# Altium schematic sheet 425AK01A_S02.SchDoc
size A3; DocumentNumber: 2; SheetNumber: 2; SheetTotal: 10; PageSetup: Record=PageOptions|CenterHorizontal=True|CenterVertical=True|PrintScale=1.01|XCorrection=1.00|YCorrection=1.00|PrintKind=1|BorderSize=5000000|LeftOffset=0|BottomOffset=0|Orientation=2|PaperLength=1000|PaperWidth=1000|Scale=100|PaperSource=15|PrintQuality=600|MediaType=1|DitherType=10|PaperKind=A3|PrintScaleMode=1; 00_Drawn: RJG; 00_Date: 8APR2022; 00_Checked: SR; 00_Approved: GN; 00_Line1: Microcontroller
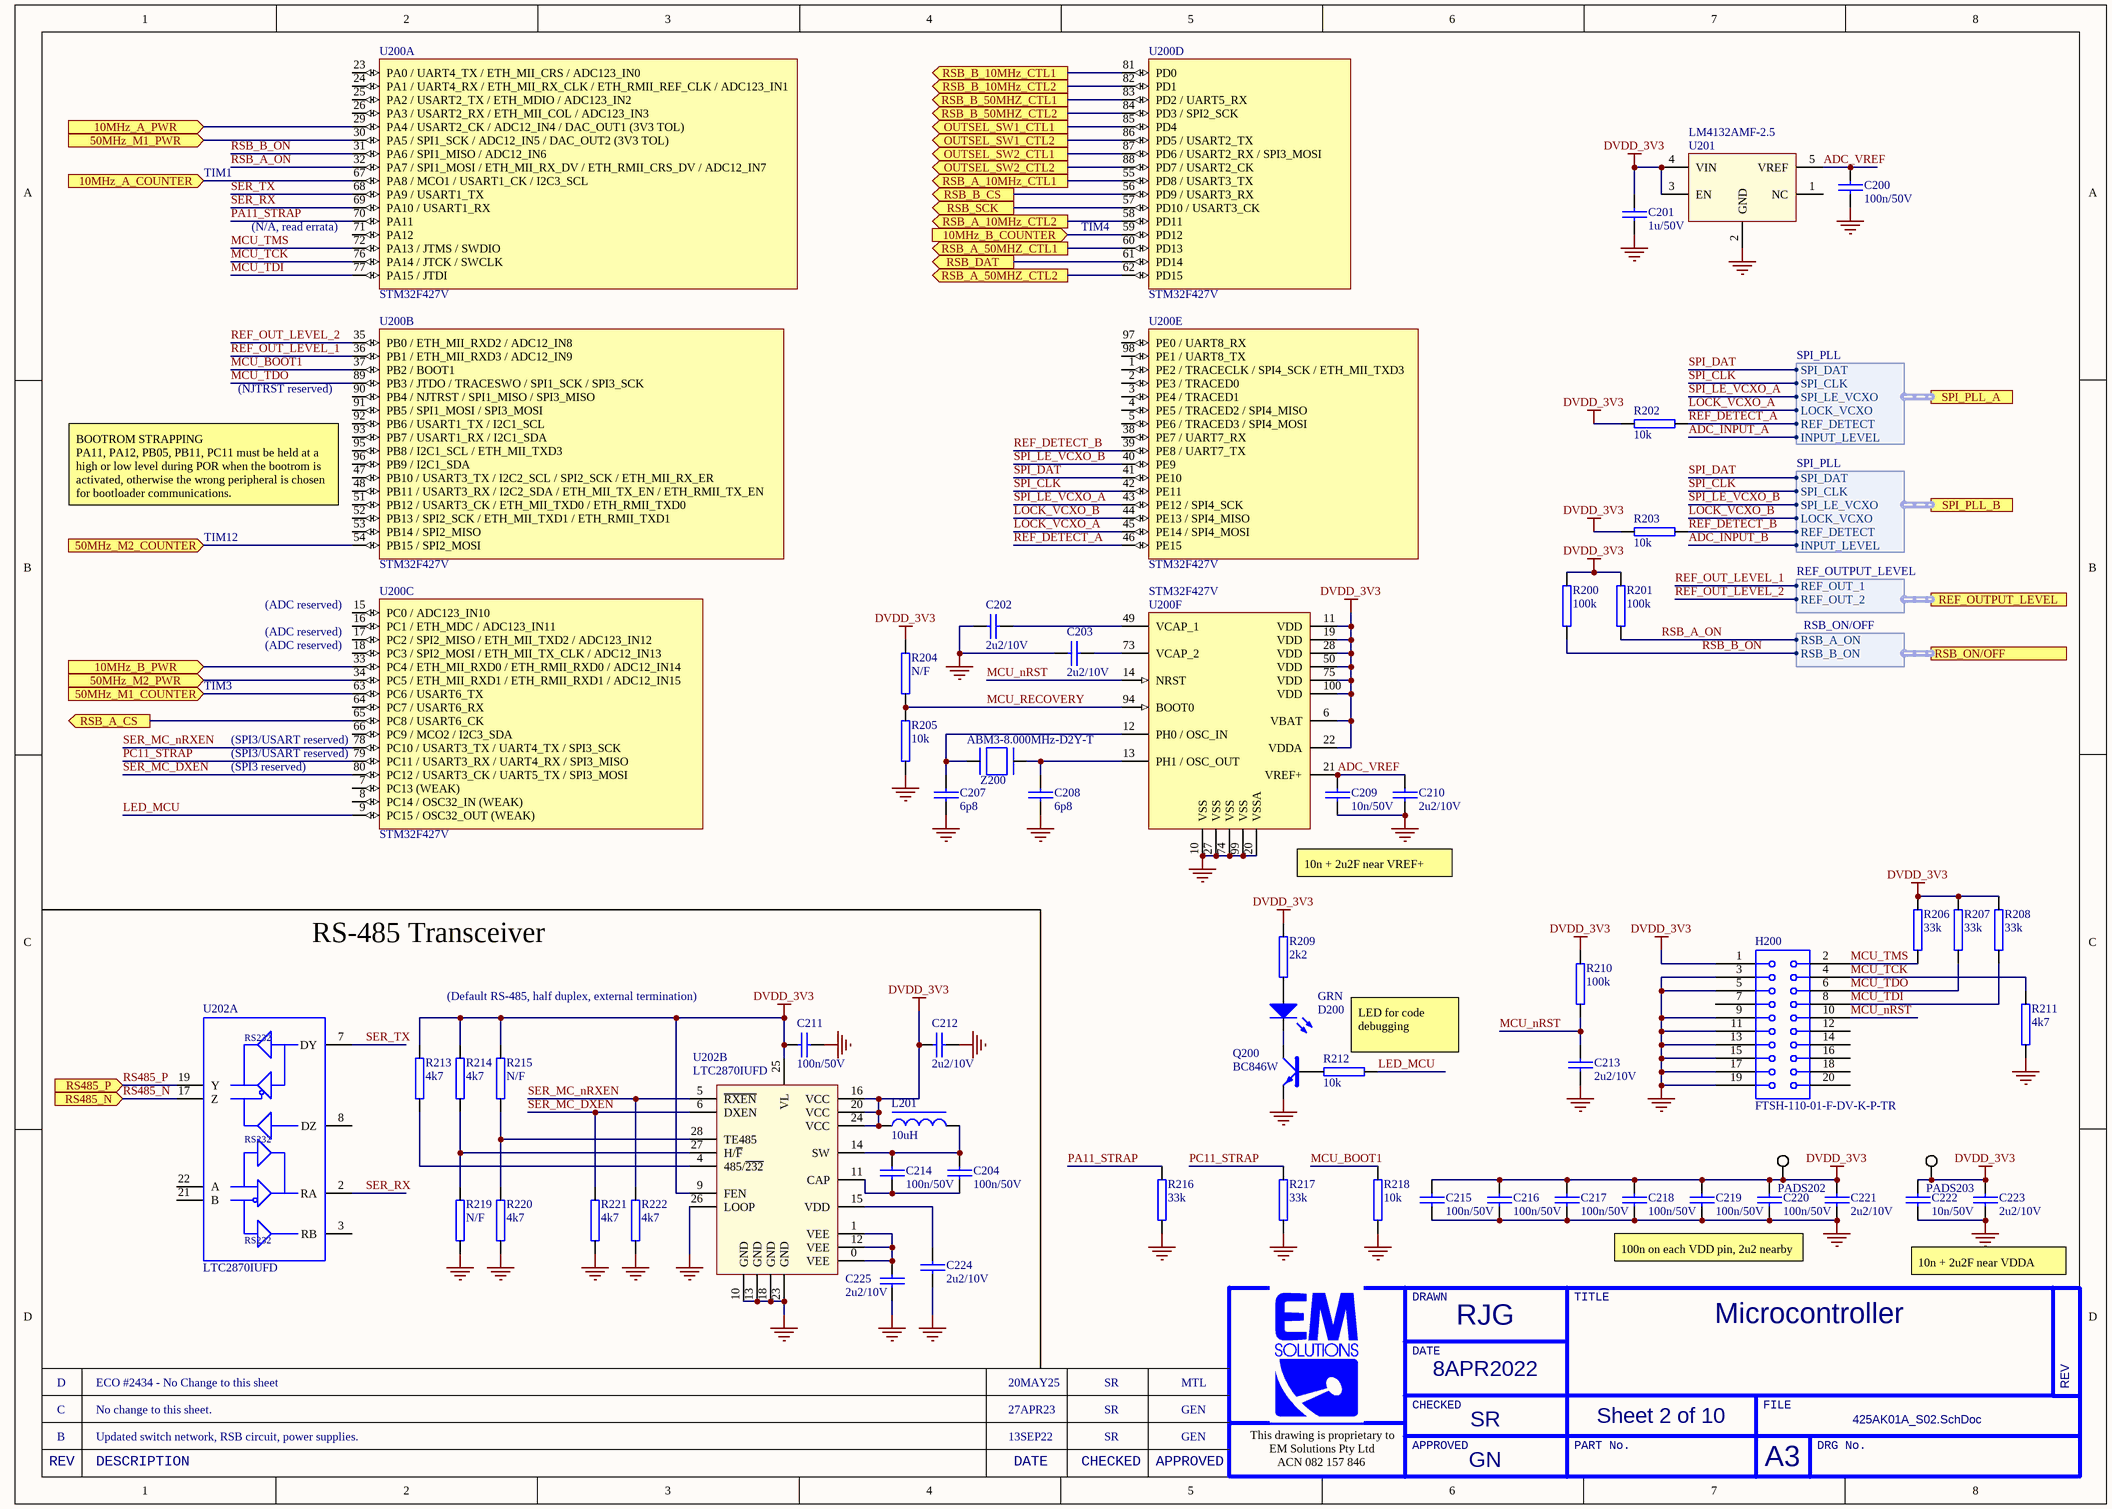
[diagram p0: 425AK01A_S02.SchDoc]

## Parts
C200  100n/50V  [0402C]
C201  1u/50V  [0603C]
C202  2u2/10V  [0603C]
C203  2u2/10V  [0603C]
C204  100n/50V  [0402C]
C207  6p8  [0402C]
C208  6p8  [0402C]
C209  10n/50V  [0402C]
C210  2u2/10V  [0603C]
C211  100n/50V  [0402C]
C212  2u2/10V  [0603C]
C213  2u2/10V  [0603C]
C214  100n/50V  [0402C]
C215  100n/50V  [0402C]
C216  100n/50V  [0402C]
C217  100n/50V  [0402C]
C218  100n/50V  [0402C]
C219  100n/50V  [0402C]
C220  100n/50V  [0402C]
C221  2u2/10V  [0603C]
C222  10n/50V  [0402C]
C223  2u2/10V  [0603C]
C224  2u2/10V  [0603C]
C225  2u2/10V  [0603C]
D200  GRN  [0603 LED]
H200  FTSH-110-01-F-DV-K-P-TR  [FTSH-110-01-F-DV-K]
L201  10uH  [0805L]
PADS202  Pads  [Pads-1x3-V3-0.3/0.6mm]  (value not drawn)  (net tie, no BOM)
PADS203  Pads  [Pads-1x3-V3-0.3/0.6mm]  (value not drawn)  (net tie, no BOM)
Q200  BC846W  [SOT-323BJT]
R200  100k  [0402]
R201  100k  [0402]
R202  10k  [0402]
R203  10k  [0402]
R204  N/F  [0402]
R205  10k  [0402]
R206  33k  [0402]
R207  33k  [0402]
R208  33k  [0402]
R209  2k2  [0402]
R210  100k  [0402]
R211  4k7  [0402]
R212  10k  [0402]
R213  4k7  [0402]
R214  4k7  [0402]
R215  N/F  [0402]
R216  33k  [0402]
R217  33k  [0402]
R218  10k  [0402]
R219  N/F  [0402]
R220  4k7  [0402]
R221  4k7  [0402]
R222  4k7  [0402]
U200  STM32F427V  [LQFP100]  (parts A,B,C,D,E,F of 6)
U201  LM4132AMF-2.5  [SOT-23/5]
U202  LTC2870IUFD  [QFN-28 4x5mm]  (parts A,B of 2)
Z200  ABM3-8.000MHz-D2Y-T  [ABM3]

## Ports
10MHz_A_COUNTER (in), 10MHz_A_PWR (in), 10MHz_B_COUNTER (in), 10MHz_B_PWR (in), 50MHz_M1_COUNTER (in), 50MHz_M1_PWR (in), 50MHz_M2_COUNTER (in), 50MHz_M2_PWR (in), OUTSEL_SW1_CTL1 (out), OUTSEL_SW1_CTL2 (out), OUTSEL_SW2_CTL1 (out), OUTSEL_SW2_CTL2 (out), REF_OUTPUT_LEVEL (harness REF_OUTPUT_LEVEL), RS485_N (in), RS485_P (in), RSB_A_10MHz_CTL1 (out), RSB_A_10MHz_CTL2 (out), RSB_A_50MHZ_CTL1 (out), RSB_A_50MHZ_CTL2 (out), RSB_A_CS (out), RSB_B_10MHz_CTL1 (out), RSB_B_10MHz_CTL2 (out), RSB_B_50MHZ_CTL1 (out), RSB_B_50MHZ_CTL2 (out), RSB_B_CS (out), RSB_DAT (out), RSB_ON/OFF (harness RSB_ON/OFF), RSB_SCK (out), SPI_PLL_A (harness SPI_PLL), SPI_PLL_B (harness SPI_PLL)

## Harnesses
SPI_PLL: SPI_LE_VCXO, SPI_CLK, SPI_DAT, REF_DETECT, LOCK_VCXO, INPUT_LEVEL
REF_OUTPUT_LEVEL: REF_OUT_1, REF_OUT_2
RSB_ON/OFF: RSB_A_ON, RSB_B_ON

## Nets
DVDD_3V3: C201.1 C211.1 C212.1 C215.1 C216.1 C217.1 C218.1 C219.1 C220.1 C221.1 C222.1 C223.1 H200.1 L201.1 PADS202.1 PADS203.1 R200.2 R201.2 R202.2 R203.2 R204.2 R206.2 R207.2 R208.2 R209.2 R210.2 R213.2 R214.2 R215.2 U200.6(VBAT) U200.11(VDD) U200.19(VDD) U200.22(VDDA) U200.28(VDD) U200.50(VDD) U200.75(VDD) U200.100(VDD) U201.3(EN) U201.4(VIN) U202.9(FEN) U202.16(VCC) U202.20(VCC) U202.24(VCC) U202.25(VL)
GND: C200.1 C201.2 C202.1 C203.2 C207.2 C208.2 C209.2 C210.2 C211.2 C212.2 C213.2 C215.2 C216.2 C217.2 C218.2 C219.2 C220.2 C221.2 C222.2 C223.2 C224.2 C225.2 H200.3 H200.5 H200.9 H200.11 H200.13 H200.15 H200.17 H200.19 Q200.E R205.1 R211.1 R216.1 R217.1 R218.1 R219.1 R220.1 R221.2 R222.1 U200.10(VSS) U200.20(VSSA) U200.27(VSS) U200.74(VSS) U200.99(VSS) U201.2(GND) U202.10(GND) U202.13(GND) U202.18(GND) U202.23(GND) U202.26(LOOP)
10MHz_A_COUNTER: U200.67(PA8_/_MCO1_/_USART1_CK_/_I2C3_SCL) ; port 10MHz_A_COUNTER
10MHz_A_PWR: U200.29(PA4_/_USART2_CK_/_ADC12_IN4_/_DAC_OUT1_(3V3_TOL)) ; port 10MHz_A_PWR
10MHz_B_COUNTER: U200.59(PD12) ; port 10MHz_B_COUNTER
10MHz_B_PWR: U200.33(PC4_/_ETH_MII_RXD0_/_ETH_RMII_RXD0_/_ADC12_IN14) ; port 10MHz_B_PWR
50MHz_M1_COUNTER: U200.63(PC6_/_USART6_TX) ; port 50MHz_M1_COUNTER
50MHz_M1_PWR: U200.30(PA5_/_SPI1_SCK_/_ADC12_IN5_/_DAC_OUT2_(3V3_TOL)) ; port 50MHz_M1_PWR
50MHz_M2_COUNTER: U200.54(PB15_/_SPI2_MOSI) ; port 50MHz_M2_COUNTER
50MHz_M2_PWR: U200.34(PC5_/_ETH_MII_RXD1_/_ETH_RMII_RXD1_/_ADC12_IN15) ; port 50MHz_M2_PWR
ADC_INPUT_A: port SPI_PLL_A.INPUT_LEVEL
ADC_INPUT_B: port SPI_PLL_B.INPUT_LEVEL
ADC_VREF: C200.2 C209.1 C210.1 U200.21(VREF+) U201.5(VREF)
LED_MCU: R212.1 U200.9(PC15_/_OSC32_OUT_(WEAK))
LOCK_VCXO_A: U200.45(PE14_/_SPI4_MOSI) ; port SPI_PLL_A.LOCK_VCXO
LOCK_VCXO_B: U200.44(PE13_/_SPI4_MISO) ; port SPI_PLL_B.LOCK_VCXO
MCU_BOOT1: R218.2 U200.37(PB2_/_BOOT1)
MCU_nRST: C213.1 H200.10 R210.1 U200.14(NRST)
MCU_RECOVERY: R204.1 R205.2 U200.94(BOOT0)
MCU_TCK: H200.4 R211.2 U200.76(PA14_/_JTCK_/_SWCLK)
MCU_TDI: H200.8 R208.1 U200.77(PA15_/_JTDI)
MCU_TDO: H200.6 R207.1 U200.89(PB3_/_JTDO_/_TRACESWO_/_SPI1_SCK_/_SPI3_SCK)
MCU_TMS: H200.2 R206.1 U200.72(PA13_/_JTMS_/_SWDIO)
OUTSEL_SW1_CTL1: U200.85(PD4) ; port OUTSEL_SW1_CTL1
OUTSEL_SW1_CTL2: U200.86(PD5_/_USART2_TX) ; port OUTSEL_SW1_CTL2
OUTSEL_SW2_CTL1: U200.87(PD6_/_USART2_RX_/_SPI3_MOSI) ; port OUTSEL_SW2_CTL1
OUTSEL_SW2_CTL2: U200.88(PD7_/_USART2_CK) ; port OUTSEL_SW2_CTL2
PA11_STRAP: R216.2 U200.70(PA11)
PC11_STRAP: R217.2 U200.79(PC11_/_USART3_RX_/_UART4_RX_/_SPI3_MISO)
REF_DETECT_A: R202.1 U200.46(PE15) ; port SPI_PLL_A.REF_DETECT
REF_DETECT_B: R203.1 U200.39(PE8_/_UART7_TX) ; port SPI_PLL_B.REF_DETECT
REF_OUT_LEVEL_1: U200.36(PB1_/_ETH_MII_RXD3_/_ADC12_IN9) ; port REF_OUTPUT_LEVEL.REF_OUT_1
REF_OUT_LEVEL_2: U200.35(PB0_/_ETH_MII_RXD2_/_ADC12_IN8) ; port REF_OUTPUT_LEVEL.REF_OUT_2
RS485_N: U202.17(Z) ; port RS485_N
RS485_P: U202.19(Y) ; port RS485_P
RSB_A_10MHz_CTL1: U200.55(PD8_/_USART3_TX) ; port RSB_A_10MHz_CTL1
RSB_A_10MHz_CTL2: U200.58(PD11) ; port RSB_A_10MHz_CTL2
RSB_A_50MHZ_CTL1: U200.60(PD13) ; port RSB_A_50MHZ_CTL1
RSB_A_50MHZ_CTL2: U200.62(PD15) ; port RSB_A_50MHZ_CTL2
RSB_A_CS: U200.65(PC8_/_USART6_CK) ; port RSB_A_CS
RSB_A_ON: R201.1 U200.32(PA7_/_SPI1_MOSI_/_ETH_MII_RX_DV_/_ETH_RMII_CRS_DV_/_ADC12_IN7) ; port RSB_ON/OFF.RSB_A_ON
RSB_B_10MHz_CTL1: U200.81(PD0) ; port RSB_B_10MHz_CTL1
RSB_B_10MHz_CTL2: U200.82(PD1) ; port RSB_B_10MHz_CTL2
RSB_B_50MHZ_CTL1: U200.83(PD2_/_UART5_RX) ; port RSB_B_50MHZ_CTL1
RSB_B_50MHZ_CTL2: U200.84(PD3_/_SPI2_SCK) ; port RSB_B_50MHZ_CTL2
RSB_B_CS: U200.56(PD9_/_USART3_RX) ; port RSB_B_CS
RSB_B_ON: R200.1 U200.31(PA6_/_SPI1_MISO_/_ADC12_IN6) ; port RSB_ON/OFF.RSB_B_ON
RSB_DAT: U200.61(PD14) ; port RSB_DAT
RSB_SCK: U200.57(PD10_/_USART3_CK) ; port RSB_SCK
SER_MC_DXEN: R221.1 U200.80(PC12_/_USART3_CK_/_UART5_TX_/_SPI3_MOSI) U202.6(DXEN)
SER_MC_nRXEN: R222.2 U200.78(PC10_/_USART3_TX_/_UART4_TX_/_SPI3_SCK) U202.5(~{RXEN})
SER_RX: U200.69(PA10_/_USART1_RX) U202.2(RA)
SER_TX: U200.68(PA9_/_USART1_TX) U202.7(DY)
SPI_CLK: U200.42(PE11) ; port SPI_PLL_A.SPI_CLK, port SPI_PLL_B.SPI_CLK
SPI_DAT: U200.41(PE10) ; port SPI_PLL_A.SPI_DAT, port SPI_PLL_B.SPI_DAT
SPI_LE_VCXO_A: U200.43(PE12_/_SPI4_SCK) ; port SPI_PLL_A.SPI_LE_VCXO
SPI_LE_VCXO_B: U200.40(PE9) ; port SPI_PLL_B.SPI_LE_VCXO
NetC202_2: C202.2 U200.49(VCAP_1)
NetC203_1: C203.1 U200.73(VCAP_2)
NetC204_1: C204.1 C214.1 U202.11(CAP)
NetC204_2: C204.2 C214.2 L201.2 U202.14(SW)
NetC207_1: C207.1 U200.12(PH0_/_OSC_IN) Z200.1
NetC208_1: C208.1 U200.13(PH1_/_OSC_OUT) Z200.2
NetC224_1: C224.1 U202.15(VDD)
NetC225_1: C225.1 U202.0(VEE) U202.1(VEE) U202.12(VEE)
NetD200_A: D200.A R209.1
NetD200_K: D200.K Q200.C
NetQ200_B: Q200.B R212.2
NetR213_1: R213.1 U202.4(485/~{232})
NetR214_1: R214.1 R219.2 U202.27(H/~{F})
NetR215_1: R215.1 R220.2 U202.28(TE485)

Not connected (* = marked no-connect by the designer): H200 7 12 14 16 18 20; U200 1(PE2_/_TRACECLK_/_SPI4_SCK_/_ETH_MII_TXD3) 2(PE3_/_TRACED0) 3(PE4_/_TRACED1) 4(PE5_/_TRACED2_/_SPI4_MISO) 5(PE6_/_TRACED3_/_SPI4_MOSI) 7(PC13_(WEAK)) 8(PC14_/_OSC32_IN_(WEAK)) 15(PC0_/_ADC123_IN10) 16(PC1_/_ETH_MDC_/_ADC123_IN11) 17(PC2_/_SPI2_MISO_/_ETH_MII_TXD2_/_ADC123_IN12) 18(PC3_/_SPI2_MOSI_/_ETH_MII_TX_CLK_/_ADC12_IN13) 23(PA0_/_UART4_TX_/_ETH_MII_CRS_/_ADC123_IN0) 24(PA1_/_UART4_RX_/_ETH_MII_RX_CLK_/_ETH_RMII_REF_CLK_/_ADC123_IN1) 25(PA2_/_USART2_TX_/_ETH_MDIO_/_ADC123_IN2) 26(PA3_/_USART2_RX_/_ETH_MII_COL_/_ADC123_IN3) 38(PE7_/_UART7_RX) 47(PB10_/_USART3_TX_/_I2C2_SCL_/_SPI2_SCK_/_ETH_MII_RX_ER) 48(PB11_/_USART3_RX_/_I2C2_SDA_/_ETH_MII_TX_EN_/_ETH_RMII_TX_EN) 51(PB12_/_USART3_CK_/_ETH_MII_TXD0_/_ETH_RMII_TXD0) 52(PB13_/_SPI2_SCK_/_ETH_MII_TXD1_/_ETH_RMII_TXD1) 53(PB14_/_SPI2_MISO) 64(PC7_/_USART6_RX) 66(PC9_/_MCO2_/_I2C3_SDA) 71(PA12) 90(PB4_/_NJTRST_/_SPI1_MISO_/_SPI3_MISO) 91(PB5_/_SPI1_MOSI_/_SPI3_MOSI) 92(PB6_/_USART1_TX_/_I2C1_SCL) 93(PB7_/_USART1_RX_/_I2C1_SDA) 95(PB8_/_I2C1_SCL_/_ETH_MII_TXD3) 96(PB9_/_I2C1_SDA) 97(PE0_/_UART8_RX) 98(PE1_/_UART8_TX); U201 1(NC); U202 3(RB) 8(DZ) 21(B) 22(A)

## Notes on the sheet
- TIM1
- (near U200) (N/A, read errata)
- (near U200) TIM4
- (near U200) (NJTRST reserved)
- (near U200) BOOTROM STRAPPING
  PA11, PA12, PB05, PB11, PC11 must be held at a
  high or low level during POR when the bootrom is
  activated, otherwise the wrong peripheral is chosen
  for bootloader communications.
- TIM12
- (near U200) (ADC reserved)
- TIM3
- (near U200) (SPI3/USART reserved)
- (SPI3 reserved)
- (near U200) 10n + 2u2F near VREF+
- RS-485 Transceiver
- (Default RS-485, half duplex, external termination)
- (near R212) LED for code debugging
- 100n on each VDD pin, 2u2 nearby
- 10n + 2u2F near VDDA
- D
- ECO #2434 - No Change to this sheet
- 20MAY25
- SR
- MTL
- B
- C
- Updated switch network, RSB circuit, power supplies.
- No change to this sheet.
- 13SEP22
- 27APR23
- GEN
- DRAWN
- TITLE
- DATE
- REV
- This drawing is proprietary to
- EM Solutions Pty Ltd
- APPROVED
- CHECKED
- PART No.
- FILE
- A3
- DRG No.
- DESCRIPTION
- ACN 082 157 846
- (in symbol 53-2870-01, part A) RS232

## Library data of the parts
C200 C215-C220 = 41-100N-13: Capacitor, 0402, 100n, X7R, 10% 50V, Ceramic; MANUFACTURER: MURATA; ID: 2441; MODELNAME: GRM155R71H104KE14J; Part Number: 41-100N-13; ItemID: 41-100N-13
C201 = 41-01U0-06: Capacitor, 0603, 1u X7R 10% 50V Ceramic, NiSn; MANUFACTURER: TAIYOYUDEN; ID: 2287; MODELNAME: UMK107AB7105KA; Part Number: 41-01U0-06; ItemID: 41-01U0-06
C202 C203 C210 C212 C213 C221 C223-C225 = 41-02U2-06: Capacitor, 0603, 2u2 X7R 10% 10V Ceramic, NiSn; MANUFACTURER: MURATA; ID: 2333; MODELNAME: GRM188R71A225KE15D; Part Number: 41-02U2-06; ItemID: 41-02U2-06
C204 C211 C214 = 41-100N-13: Capacitor, 0402, 100n, X7R, 10% 50V, Ceramic; MANUFACTURER: MURATA; MODELNAME: GRM155R71H104KE14J; ID: 2441; Part Number: 41-100N-13; ItemID: 41-100N-13
C207 C208 = 41-06P8-05: Capacitor, 0402, 6p8 NPO +/- 0.1p 50V HiQ, NiSn; MANUFACTURER: MURATA; ID: 2410; MODELNAME: GJM1555C1H6R8BB01D; Part Number: 41-06P8-05; ItemID: 41-06P8-05
C209 C222 = 41-010N-12: Capacitor, 0402, 10n X7R 10% 50V Ceramic, NiSn; MANUFACTURER: MURATA; ID: 2217; MODELNAME: GCM155R71H103KA55D; Part Number: 41-010N-12; ItemID: 41-010N-12
D200 = 57-190-01: LED, Green, 0603, 35mcd @ 20mA; MANUFACTURER: LIGHTON; ID: 3517; MODELNAME: LTST-C190KGKT; Part Number: 57-190-01; ItemID: 57-190-01
H200 = 20-H20-04: PCB Header, 10+10way, 1.27mm, Polarised, SMD, Pick and Place; MANUFACTURER: SAMTEC; ID: 1947; Part Number: 20-H20-04; ItemID: 20-H20-04; MODELNAME: FTSH-110-01-F-DV-K-P-TR
L201 = 46-010U-03: Inductor, Chip, 10uH 20%, SRF=50MHz, 0805 MLZ series; MANUFACTURER: TDK; ID: 3129; MODELNAME: MLZ2012M100WT000; Part Number: 46-010U-03; ItemID: 46-010U-03
PADS202 PADS203 = Pads: Cluster of pads
Q200 = 62-BC846-01: Transistor, NPN Si, GenPur 65V 100mA, SOT-323; MANUFACTURER: TAIWAN SEMI; MODELNAME: BC846CW RF; ID: 3683; Part Number: 62-BC846-01; ItemID: 62-BC846-01
R200 R201 R210 = 44-100K-10: Resistor, 0402, 100k 1% 0.063W; MANUFACTURER: PHILIPS; ID: 2931; MODELNAME: RC32H; Part Number: 44-100K-10; ItemID: 44-100K-10
R202 R203 R205 R212 R218 = 44-010K-10: Resistor, 0402, 10k 1% 0.063W; MANUFACTURER: PHILIPS; ID: 2542; MODELNAME: RC0402FR-0710KL; Part Number: 44-010K-10; ItemID: 44-010K-10
R204 = 44-N/F-10: Resistor, 0402, SOT, Not Fitted; ID: 3111; Part Number: 44-N/F-10; ItemID: 44-N/F-10
R206-R208 R216 R217 = 44-033K-10: Resistor, 0402, 33k 1% 0.063W; MANUFACTURER: PHILIPS; ID: 2720; MODELNAME: RC32H; Part Number: 44-033K-10; ItemID: 44-033K-10
R209 = 44-02K2-10: Resistor, 0402, 2k2 1% 0.063W; MANUFACTURER: PHILIPS; ID: 2688; MODELNAME: RC32H; Part Number: 44-02K2-10; ItemID: 44-02K2-10
R211 = 44-04K7-10: Resistor, 0402, 4k7 1% 0.063W; MANUFACTURER: PHILIPS; ID: 2794; MODELNAME: ERJ-2RKF4701X; Part Number: 44-04K7-10; ItemID: 44-04K7-10
R213 R220-R222 = 44-04K7-10: Resistor, 0402, 4k7 1% 0.063W; MANUFACTURER: PHILIPS; MODELNAME: ERJ-2RKF4701X; ID: 2794; Part Number: 44-04K7-10; ItemID: 44-04K7-10
R214 = 44-04K7-10: Resistor, 0402, 4k7 1% 0.063W; MANUFACTURER: GENERIC; ID: 2794; Part Number: 44-04K7-10; MODELNAME: GENERIC; ItemID: 44-04K7-10
R215 R219 = 44-N/F-10: Resistor,0402,SOT,Not Fitted; MANUFACTURER: PHILIPS; MODELNAME: RC32H; ID: 3111; Part Number: 44-N/F-10; ItemID: 44-N/F-10
U200 = 51-32F427-01: Microcontroller, ARM, 32b, 180MHz, 2M Flash, 3V, Ethernet, LQFP100; MANUFACTURER: ST; ID: 3306; MODELNAME: STM32F427VIT6; Part Number: 51-32F427-01; ItemID: 51-32F427-01
U201 = 52-4132-02: Voltage Ref, 2.5V +/-0.05%, 20ppm/degC, -40/+125degC, SOT-23/5; MANUFACTURER: TI; ID: 3377; MODELNAME: LM4132AMF-2.5/NOPB; Part Number: 52-4132-02; ItemID: 52-4132-02
U202 = 53-2870-01: Transceiver RS422/485/RS232, 3V, ESD, -40/+85, QFN28; MANUFACTURER: LIN TECH; MODELNAME: LTC2870IUFD#PBF; ID: 3442; Part Number: 53-2870-01; ItemID: 53-2870-01
Z200 = 37-0102: Cryst, 8.00MHz, +/-30ppm -40/+85, +/-20ppmCal, 18pF, SMD5x3.2; ID: 2114; Part Number: 37-0102; ItemID: 37-0102; MODELNAME: ABM3-8.000MHz-D2Y-T